# EasyEDA schematic SCH_IoT RECEIVER_2024-02-11.json

## Sheets
1 LAYER1: TITLE: IoT Based Weather Station; REV: 1.0; Sheet: 1/1; Drawn By: arnoldmuhairwe; Company: MUHAIRWE
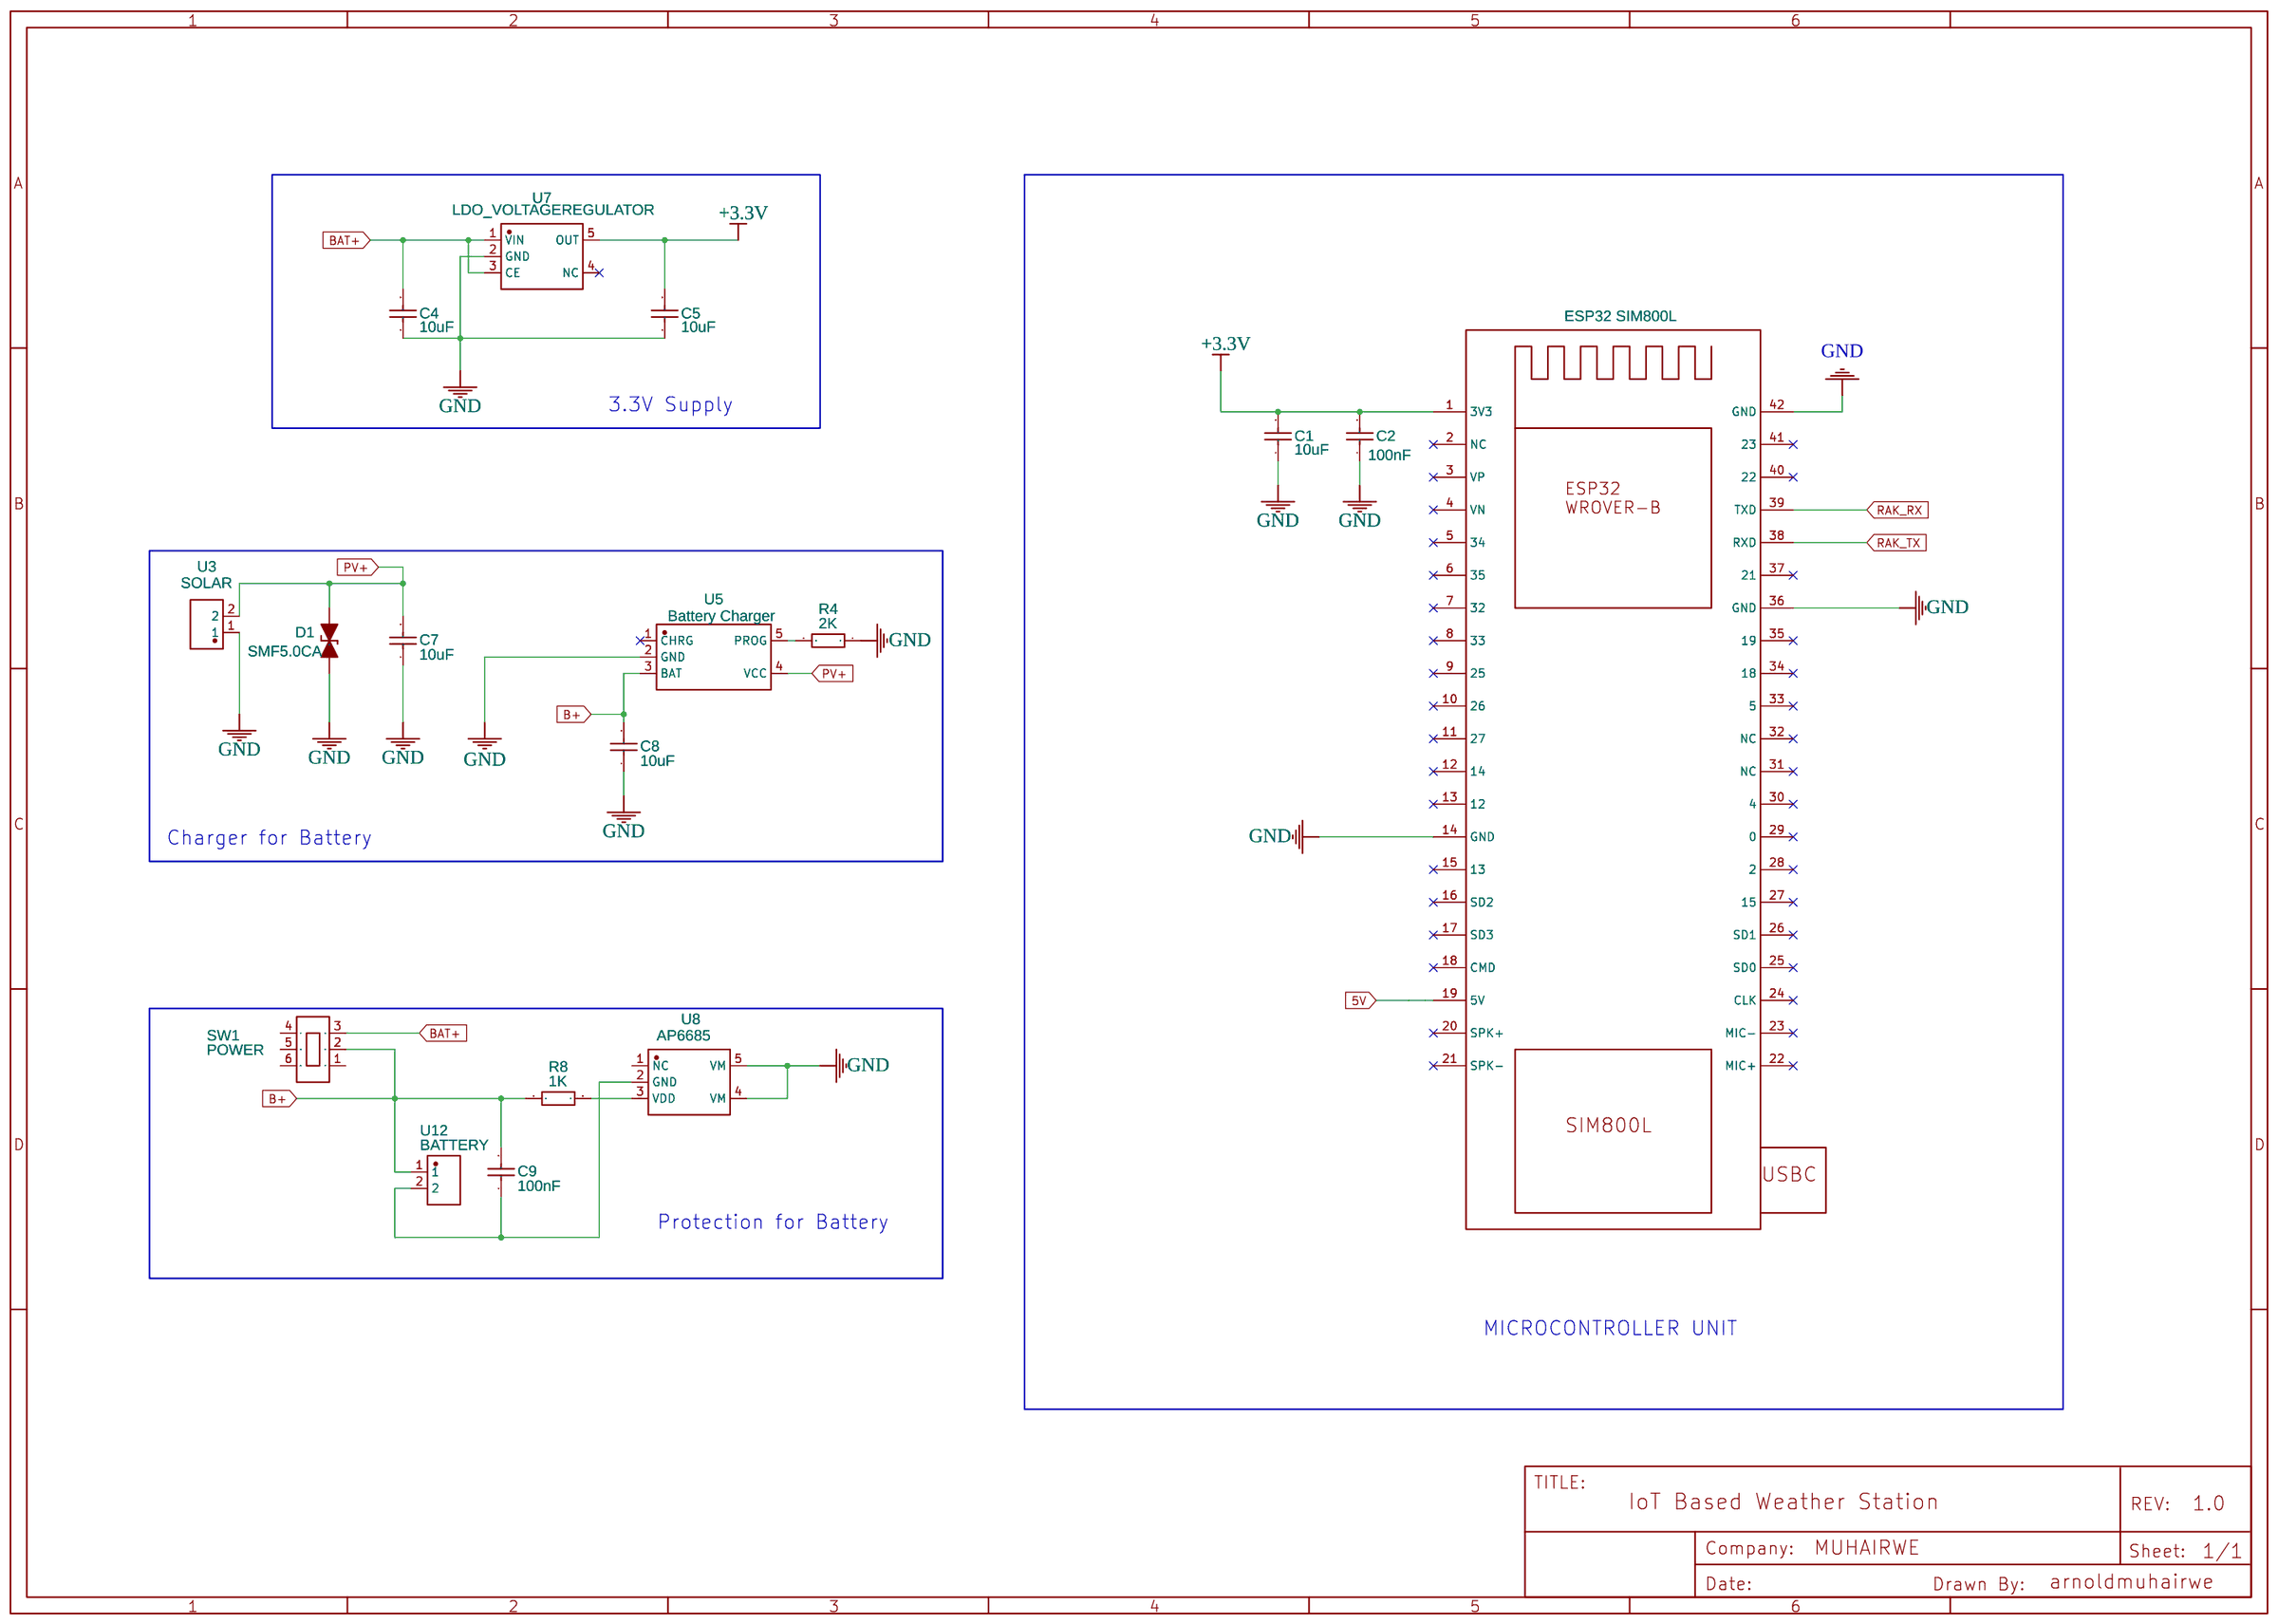
[diagram p0: LAYER1]
2 LAYER2
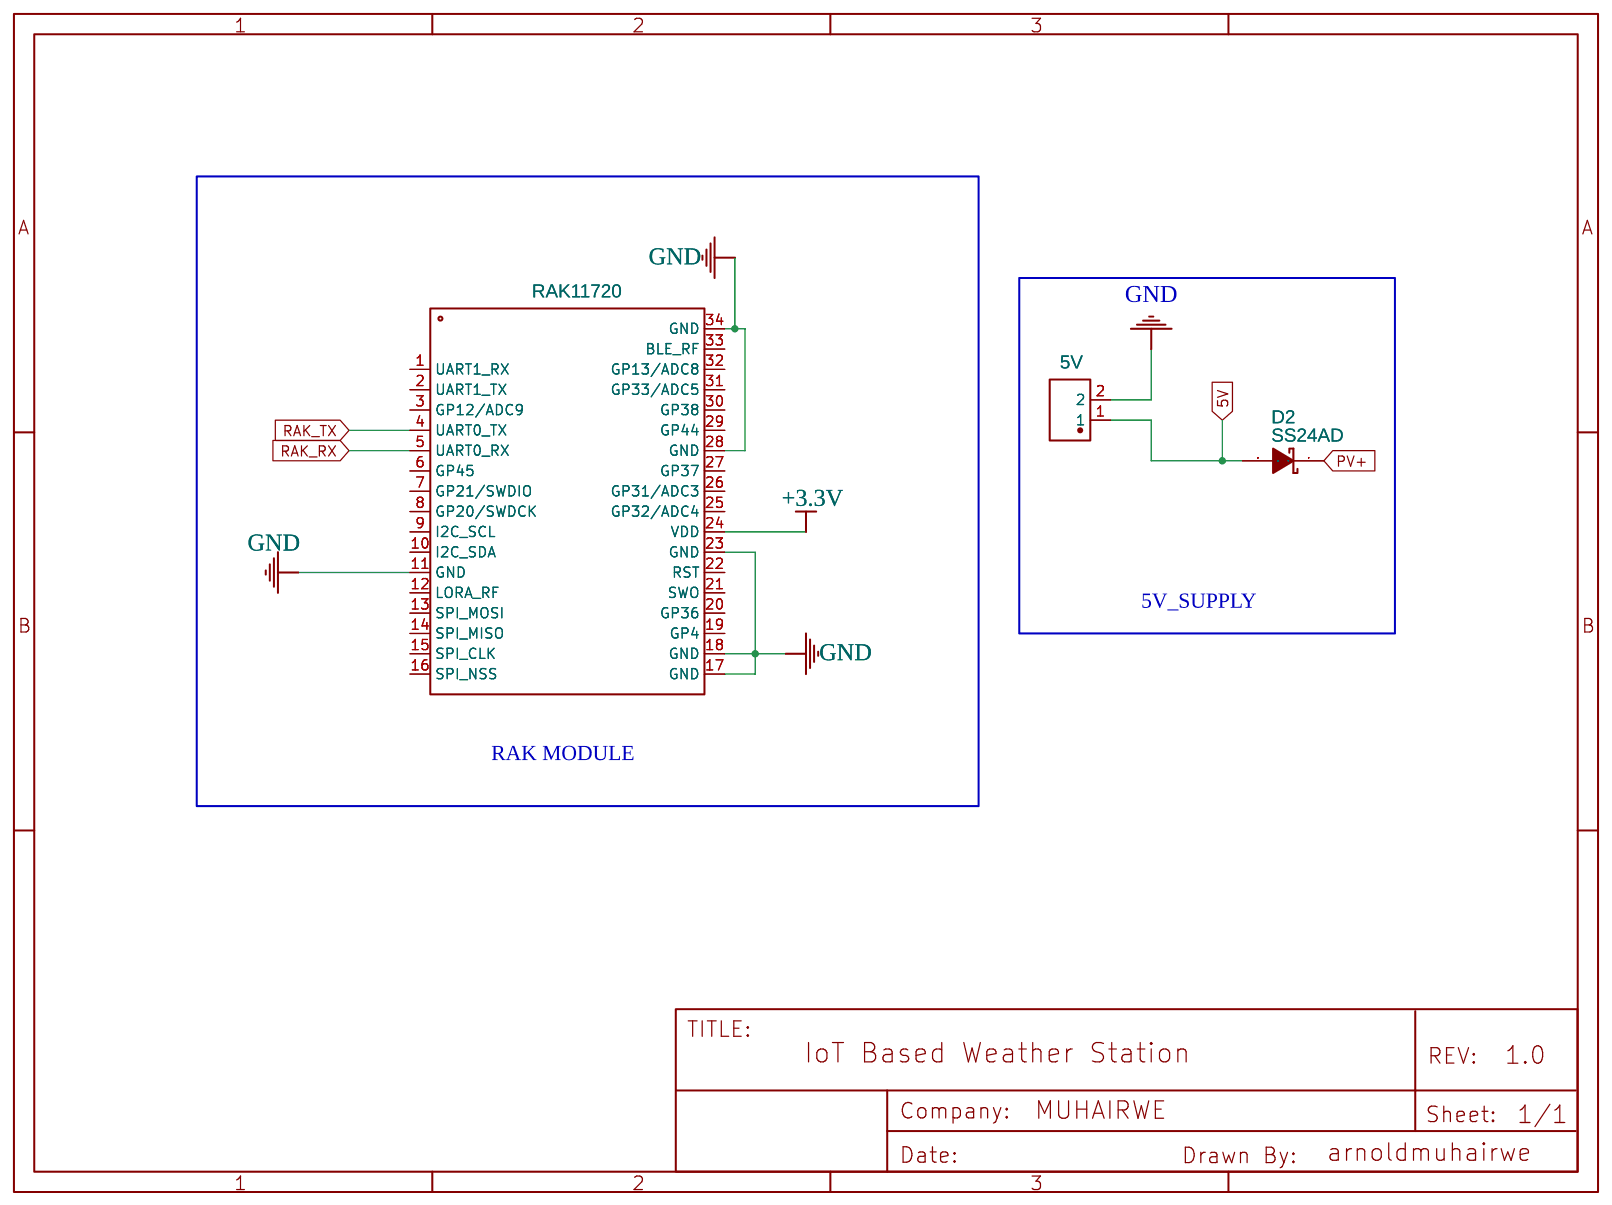
[diagram p1: LAYER2]

## Parts
sheet LAYER1
C1  10uF  [C0402]
C2  100nF  [C0402_NEW]
C4  10uF  [C0402]
C5  10uF  [C0402]
C7  10uF  [C0402_NEW]
C8  10uF  [C0402_NEW]
C9  100nF  [C0402_NEW]
D1  SMF5.0CA  [SOD-123_L2.8-W1.8-LS3.7-BI]
R4  2K  [R0402]
R8  1K  [R0402]
SW1  POWER  [SW-TH_MK-22D14-G020]
U2  ESP32 SIM800L  [T-CALL ESP32 SIM800L]
U3  SOLAR  [CONN-TH_P5.00_KF127R-5.0-2P]
U5  Battery Charger  [SOT-23-5_L2.9-W1.6-P0.95-LS2.8-BR]
U7  LDO_VOLTAGEREGULATOR  [SOT-23-5_L2.9-W1.6-P0.95-LS2.8-BR]
U8  AP6685  [SOT-23-5_L3.0-W1.7-P0.95-LS2.8-BL]
U12  BATTERY  [CONN-TH_P5.00_KF127R-5.0-2P]
sheet LAYER2
D2  SS24AD  [SMA_L4.3-W2.6-LS5.2-RD]
U9  RAK11720  [RAK11720]
U13  5V  [CONN-TH_P5.00_KF127R-5.0-2P]

## Library data of the parts
C1 C4 C5 = CL05A106MQ5NUNC: Supplier: LCSC; Manufacturer: SAMSUNG; Supplier Part: C15525; JLCPCB Part Class: Basic Part
C2 = CL05B104KO5NNNC: Supplier: LCSC; Manufacturer: SAMSUNG; Supplier Part: C1525; JLCPCB Part Class: Basic Part
C7-C9 = CL05B104KO5NNNC: Supplier: LCSC; Manufacturer: SAMSUNG; Supplier Part: C1525; JLCPCB Part Class: Basic Part; Package Display: No
D1 = SMF5.0CA: Supplier: LCSC; Supplier Part: C266716; Manufacturer: FMS(美丽微); Contributor: LCSC; JLCPCB Part Class: Extended Part
R4 R8 = 0402WGF2000TCE: Supplier: LCSC; Manufacturer: UniOhm; Supplier Part: C25087; JLCPCB Part Class: Basic Part
SW1 = MK-22D14-G020: Supplier: LCSC; Supplier Part: C963207; Manufacturer: G-Switch(品赞); Contributor: LCSC; JLCPCB Part Class: Extended Part
U2 = T-Call ESP32 SIM800L: Manufacturer: T-Call; Supplier: LCSC; link: https://raw.githubusercontent.com/Xinyuan-LilyGO/TTGO-T-Call/master/datasheet/T-Call.jpg; Contributor: Mounoy Dev
U3 U12 U13 = KF127R-5.0-2P: Supplier: LCSC; Supplier Part: C474908; Manufacturer: Cixi Kefa Elec; Contributor: LCSC; JLCPCB Part Class: Extended Part
U5 = LP4060AB5F-435: Supplier: LCSC; Supplier Part: C517026; Manufacturer: LOWPOWER(微源半导体); Contributor: LCSC; JLCPCB Part Class: Extended Part
U7 = XC6220B331MR: Supplier: LCSC; Supplier Part: C3040644; Manufacturer: TECH PUBLIC(台舟); link: https://atta.szlcsc.com/upload/public/pdf/source/20220630/EC7D0F989934709C5AE69B489B953B17.pdf; Contributor: lcsc
U8 = AP6685: Supplier: LCSC; Supplier Part: C2849566; Manufacturer: ALLPOWER(铨力); Contributor: LCSC
D2 = SS24AD: Supplier: LCSC; Manufacturer: ST(先科); Supplier Part: C84503; JLCPCB Part Class: Extended Part
U9 = RAK11720: Manufacturer: RAKwireless; Manufacturer Part: RAKwireless; Supplier: rakwirelles; Supplier Part: RAK3172; Contributor: Berislav Vezilic; Link: https://store.rakwireless.com/collections/wisduo-module/products/wisduo-lpwan-module-rak3172?variant=40014759461062

## Nets
5V: D2.2(A) U2.19(5V) U13.1
+3.3V: C1.2 C2.2 C5.2 U2.1(3V3) U7.5(OUT) U9.24(VDD)
GND: C1.1 C2.1 C4.1 C5.1 C7.1 C8.1 D1.1(K) R4.1 U2.14(GND) U2.36(GND) U2.42(GND) U3.1 U5.2(GND) U7.2(GND) U8.4(VM) U8.5(VM) U9.11(GND) U9.17(GND) U9.18(GND) U9.23(GND) U9.28(GND) U9.34(GND) U13.2
B+: C8.2 C9.2 R8.2 SW1.2 U5.3(BAT) U12.1
BAT+: C4.2 SW1.3 U7.1(VIN) U7.3(CE)
PV+: C7.2 D1.2(A) D2.1(C) U3.2 U5.4(VCC)
RAK_RX: U2.39(TXD) U9.5(UART0_RX)
RAK_TX: U2.38(RXD) U9.4(UART0_TX)
Net-(C9-1): C9.1 U8.2(GND) U12.2
Net-(R4-2): R4.2 U5.5(PROG)
Net-(R8-1): R8.1 U8.3(VDD)

Not connected (* = marked no-connect by the designer): SW1 1 4 5 6; U2 2(NC)* 3(VP)* 4(VN)* 5(34)* 6(35)* 7(32)* 8(33)* 9(25)* 10(26)* 11(27)* 12(14)* 13(12)* 15(13)* 16(SD2)* 17(SD3)* 18(CMD)* 20(SPK+)* 21(SPK-)* 22(MIC+)* 23(MIC-)* 24(CLK)* 25(SD0)* 26(SD1)* 27(15)* 28(2)* 29(0)* 30(4)* 31(NC)* 32(NC)* 33(5)* 34(18)* 35(19)* 37(21)* 40(22)* 41(23)*; U5 1(CHRG)*; U7 4(NC)*; U8 1(NC); U9 1(UART1_RX) 2(UART1_TX) 3(GP12/ADC9) 6(GP45) 7(GP21/SWDIO) 8(GP20/SWDCK) 9(I2C_SCL) 10(I2C_SDA) 12(LORA_RF) 13(SPI_MOSI) 14(SPI_MISO) 15(SPI_CLK) 16(SPI_NSS) 19(GP4) 20(GP36) 21(SWO) 22(RST) 25(GP32/ADC4) 26(GP31/ADC3) 27(GP37) 29(GP44) 30(GP38) 31(GP33/ADC5) 32(GP13/ADC8) 33(BLE RF)

## Notes on the sheets
sheet 1
- 3.3V Supply
- Charger for Battery
- Protection for Battery
- MICROCONTROLLER UNIT
sheet 2
- 5V_SUPPLY
- RAK MODULE
